# Altium schematic sheet Power Circuit.SchDoc
size A3; SheetNumber: 3; SheetTotal: 6
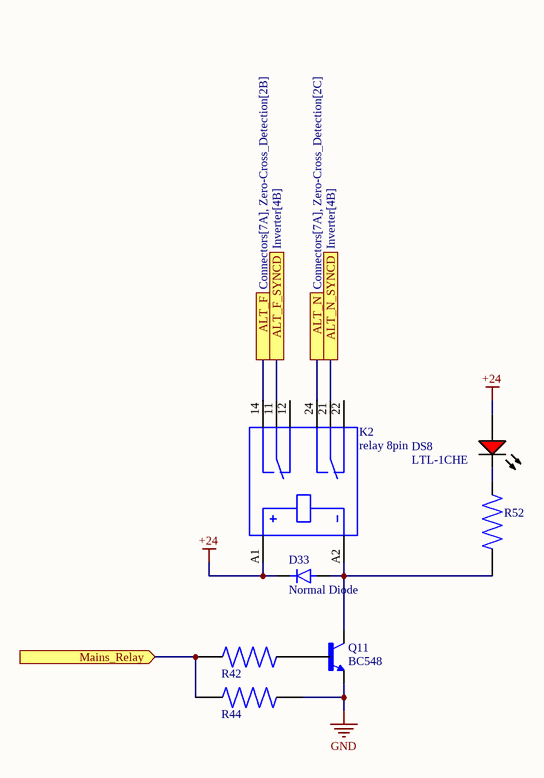
[diagram p0: Power Circuit.SchDoc]

## Parts
D33  Normal Diode  [Common Trhough Hole]
DS8  LTL-1CHE  [LED3mm]
K2  relay 8pin  [Relay socket 8pin]
Q11  BC548  [bc548]
R42  Resistor_Through Hole  [Resistor_Through Hole]  (value not drawn)
R44  Resistor_Through Hole  [Resistor_Through Hole]  (value not drawn)
R52  Resistor_Through Hole  [Resistor_Through Hole]  (value not drawn)

## Ports
ALT_F (see Connectors[7A], Zero-Cross_Detection[2B]), ALT_F_SYNCD (see Inverter[4B]), ALT_N (see Connectors[7A], Zero-Cross_Detection[2C]), ALT_N_SYNCD (see Inverter[4B]), Mains_Relay (in)

## Nets
+24: D33.1(K) DS8.1(A) K2.A1
GND: Q11.3(E) R44.1
ALT_F: K2.14 ; port ALT_F
ALT_F_SYNCD: K2.11 ; port ALT_F_SYNCD
ALT_N: K2.24 ; port ALT_N
ALT_N_SYNCD: K2.21 ; port ALT_N_SYNCD
Mains_Relay: R42.2 R44.2 ; port Mains_Relay
NetD33_2: D33.2(A) K2.A2 Q11.1(C) R52.2
NetDS8_2: DS8.2(K) R52.1
NetQ11_2: Q11.2(B) R42.1

Not connected (* = marked no-connect by the designer): K2 12(7) 22(2)

## Library data of the parts
D33 = Normal Diode: MF: NTE Electronics, Inc.; MP: 1N4007; Package: DO-41 NTE Electronics; Check_prices: https://www.snapeda.com/parts/1N4007/NTE+Electronics/view-part/?ref=eda; Value: *; Purchase-URL: https://pricing.snapeda.com/search/part/1N4007/?ref=eda; Availability: In Stock; SnapEDA_Link: https://www.snapeda.com/parts/1N4007/NTE+Electronics/view-part/?ref=snap; Price: None
DS8 = RED_LED 3mm: Radial LED, 12.6 mcd, 20 mA, 2 V, -55 to 100 degC, 2-Pin THD, RoHS, Bulk; Shielding: Unshielded; Resistance: 0.045 Ohm; Current Rating: 3.6 A; Tolerance: 20%; PackageReference: LTL-1CHE; PackageDescription: 2-Pin Through Hole Device, Dia 3.8 mm, Pitch 2.54 mm; Case\Package: Radial; Length: 0.97 inch; Width: 0.62 inch; Height: 1.1 inch; Radiation Hardening: No; Lead Pitch: 11.44 mm; ComponentLink1URL: http://www.us.liteon.com/; ComponentLink1Description: Manufacturer URL; RoHSCompliant: true; Packaging: Tray; Mount: Through Hole; Min Operating Temperature: -40 degC; Max Operating Temperature: 130 degC; ComponentLink2URL: https://datasheet.ciiva.com/15117/getdatasheetpartid-187746-15117985.pdf; Package Quantity: 55; ComponentLink2Description: Datasheet; DatasheetVersion: Dec-03
K2 = relay 8pin: General Purpose Relay DPDT _2 Form C_ 24VDC Coil Through Hole; MF: TE Connectivity; MP: 1-1393243-0; Package: None; Value: *; Availability: Unavailable; SnapEDA_Link: https://www.snapeda.com/parts/1-1393243-0/TE%20Connectivity%20Potter%20&%20Brumfield%20Relays/view-part/244556/?ref=snap; Price: None
Q11 = BC548: Bipolar (BJT) Transistor NPN 30V 100mA 300MHz 500mW Through Hole TO-92-3; MF: ON Semiconductor; DigiKey-Purchase-URL: https://snapeda.com/shop?store=DigiKey&id=2007035; MP: BC548; Availability: Warning; Package: TO-92 ON Semiconductor; Value: *; SnapEDA_Link: https://www.snapeda.com/parts/BC548/ON%20Semiconductor/view-part/2007035/?ref=snap; Price: None
R42 R44 R52 = Resistor_Through Hole: 1.02 Ohms Â±1% 0.25W, 1/4W Through Hole Resistor Axial Metal Film; MP: MFR-25FTE52-1R; MF: Yageo; Availability: Warning; Value: *; Check_prices: https://www.snapeda.com/parts/MFR-25FTE52-1R/Yageo/view-part/4629919/?ref=eda; Package: Axial Yageo; Price: None; SnapEDA_Link: https://www.snapeda.com/parts/MFR-25FTE52-1R/Yageo/view-part/4629919/?ref=snap; Purchase-URL: https://pricing.snapeda.com/search/part/MFR-25FTE52-1R/?ref=eda